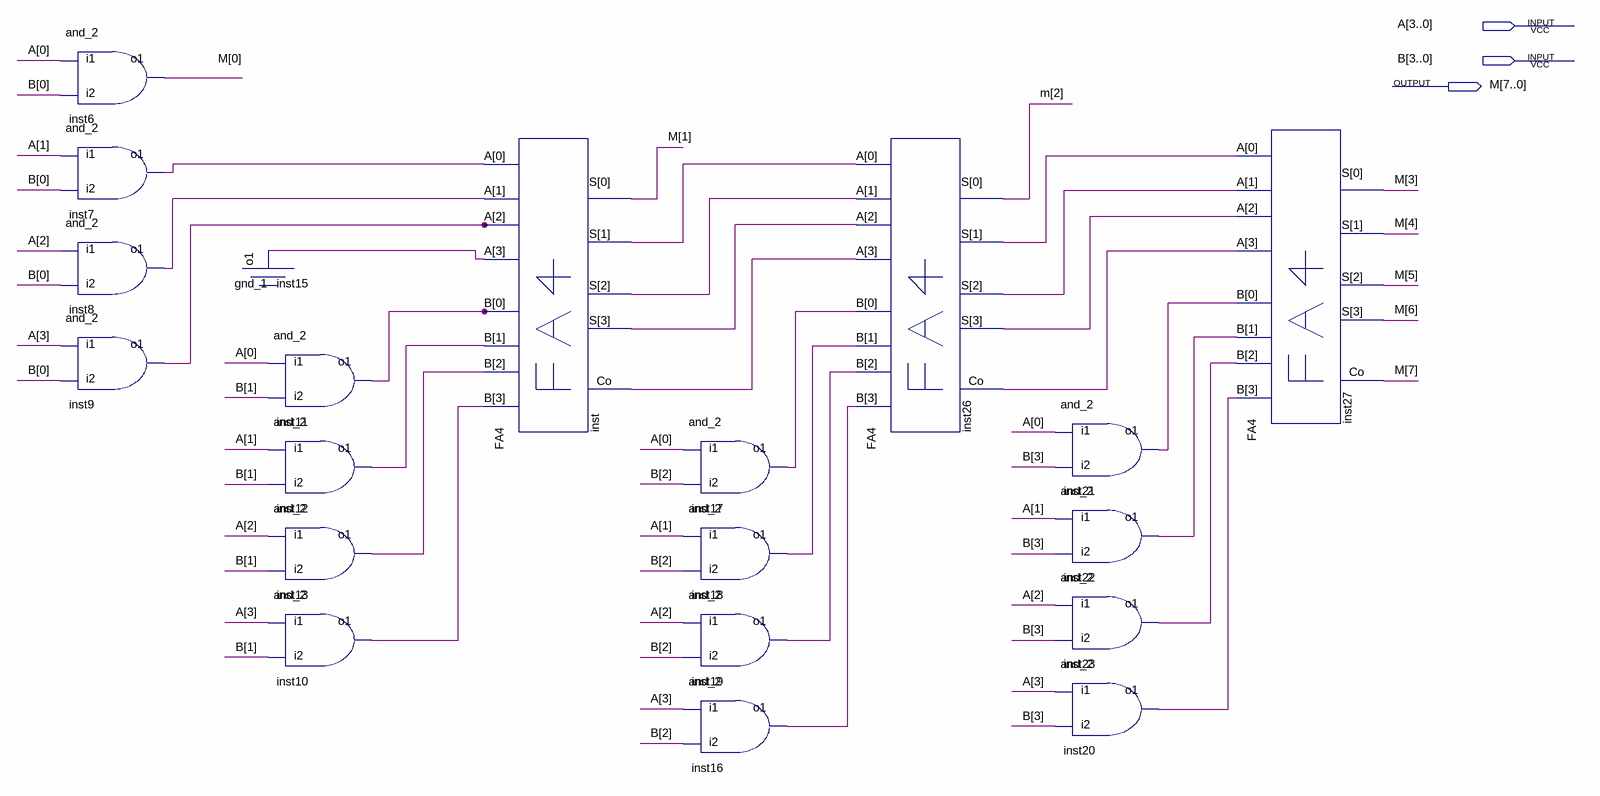
[diagram p0: schematic sheet]
// Quartus schematic MU4.bdf as structural Verilog: 20 symbols, 3 pins
module MU4 (
  input  [3:0] A,
  input  [3:0] B,
  output [7:0] M
);

  wire inst7_o1, inst8_o1, inst9_o1, inst10_o1, inst11_o1, inst12_o1, inst13_o1, inst15_o1, inst16_o1,
       inst17_o1, inst18_o1, inst19_o1, inst20_o1, inst21_o1, inst22_o1, inst23_o1, inst26_co, inst26_s,
       inst26_s_2, inst26_s_3, inst_co, inst_s, inst_s_2, inst_s_3;

  and_2 inst6 (.i1(A[0]), .i2(B[0]), .o1(M[0]));
  and_2 inst7 (.i1(A[1]), .i2(B[0]), .o1(inst7_o1));
  and_2 inst8 (.i1(A[2]), .i2(B[0]), .o1(inst8_o1));
  and_2 inst9 (.i1(A[3]), .i2(B[0]), .o1(inst9_o1));
  gnd_1 inst15 (.o1(inst15_o1));
  and_2 inst11 (.i1(A[0]), .i2(B[1]), .o1(inst11_o1));
  and_2 inst12 (.i1(A[1]), .i2(B[1]), .o1(inst12_o1));
  and_2 inst13 (.i1(A[2]), .i2(B[1]), .o1(inst13_o1));
  and_2 inst10 (.i1(A[3]), .i2(B[1]), .o1(inst10_o1));
  FA4 inst (
    .A({inst15_o1, inst9_o1, inst8_o1, inst7_o1}), .B({inst10_o1, inst13_o1, inst12_o1, inst11_o1}),
    .S({inst_s_3, inst_s_2, inst_s, M[1]}), .Co(inst_co));
  and_2 inst17 (.i1(A[0]), .i2(B[2]), .o1(inst17_o1));
  and_2 inst18 (.i1(A[1]), .i2(B[2]), .o1(inst18_o1));
  and_2 inst19 (.i1(A[2]), .i2(B[2]), .o1(inst19_o1));
  and_2 inst16 (.i1(A[3]), .i2(B[2]), .o1(inst16_o1));
  FA4 inst26 (
    .A({inst_co, inst_s_3, inst_s_2, inst_s}), .B({inst16_o1, inst19_o1, inst18_o1, inst17_o1}),
    .S({inst26_s_3, inst26_s_2, inst26_s, M[2]}), .Co(inst26_co));
  and_2 inst21 (.i1(A[0]), .i2(B[3]), .o1(inst21_o1));
  and_2 inst22 (.i1(A[1]), .i2(B[3]), .o1(inst22_o1));
  and_2 inst23 (.i1(A[2]), .i2(B[3]), .o1(inst23_o1));
  and_2 inst20 (.i1(A[3]), .i2(B[3]), .o1(inst20_o1));
  FA4 inst27 (
    .A({inst26_co, inst26_s_3, inst26_s_2, inst26_s}), .B({inst20_o1, inst23_o1, inst22_o1, inst21_o1}),
    .S(M[6:3]), .Co(M[7]));
endmodule
